# Altium schematic sheet VMA.SchDoc
size A3; SheetNumber: 4; SheetTotal: 4
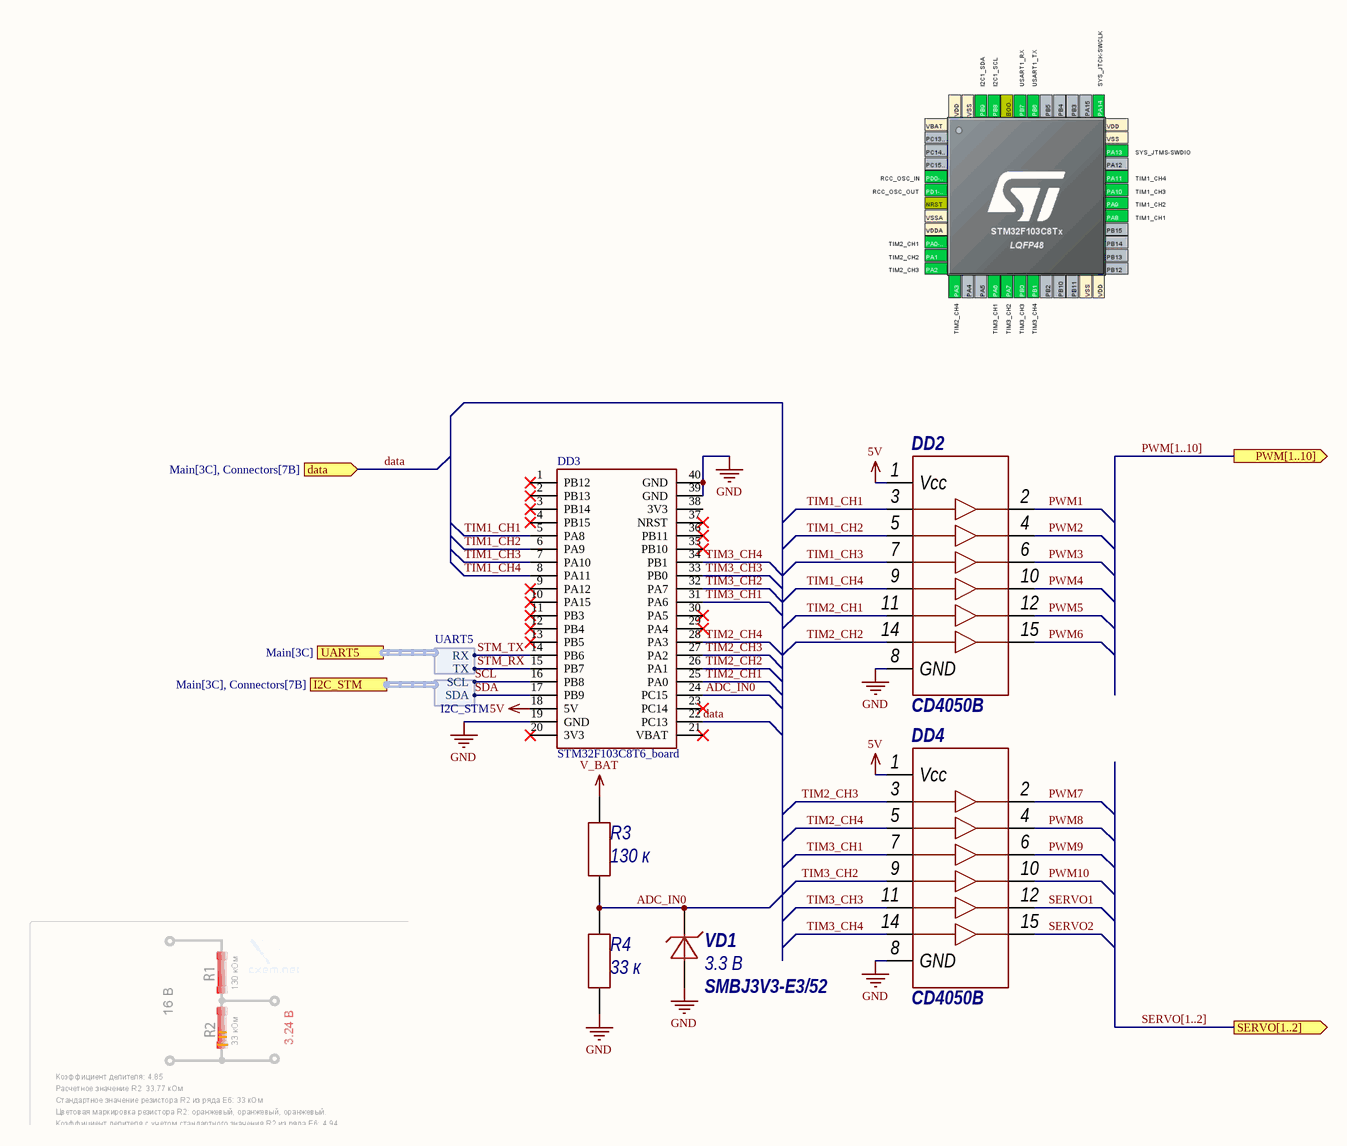
[diagram p0: VMA.SchDoc]

## Parts
DD2  CD4050B  [DIP16_in_socket]
DD3  STM32F103C8T6_board  [STM32F103C8T6_board]
DD4  CD4050B  [DIP16_in_socket]
R3  value 130 к  [0603R]  (hidden comment: Resistor)
R4  value 33 к  [0603R]  (hidden comment: Resistor)
VD1  SMBJ3V3-E3/52  value 3.3 В  [SMB]

## Ports
data (in, see Main[3C], Connectors[7B]), I2C_STM (harness I2C_STM, see Main[3C], Connectors[7B]), PWM[1..10] (out, see Main[3C], Connectors[7C]), SERVO[1..2] (out, see Main[3C], Connectors[7C]), UART5 (harness UART5, see Main[3C])

## Harnesses
UART5: TX, RX
I2C_STM: SCL, SDA

## Nets
5V: DD2.1(Vcc) DD3.18(5V) DD4.1(Vcc)
GND: DD2.8(GND) DD3.19(GND) DD3.39(GND) DD3.40(GND) DD4.8(GND) R4.1 VD1.1
V_BAT: R3.2
ADC_IN0: DD3.24(PC15) R3.1 R4.2 VD1.2
data: DD3.22(PC13) ; port data
PWM1: DD2.2(Y1)
PWM2: DD2.4(Y2)
PWM3: DD2.6(Y3)
PWM4: DD2.10(Y10)
PWM5: DD2.12(Y5)
PWM6: DD2.15(Y6)
PWM7: DD4.2(Y1)
PWM8: DD4.4(Y2)
PWM9: DD4.6(Y3)
PWM10: DD4.10(Y10)
SCL: DD3.16(PB8) ; port I2C_STM.SCL
SDA: DD3.17(PB9) ; port I2C_STM.SDA
SERVO1: DD4.12(Y5)
SERVO2: DD4.15(Y6)
STM_RX: DD3.15(PB7) ; port UART5.TX
STM_TX: DD3.14(PB6) ; port UART5.RX
TIM1_CH1: DD2.3(A1) DD3.5(PA8)
TIM1_CH2: DD2.5(A2) DD3.6(PA9)
TIM1_CH3: DD2.7(A3) DD3.7(PA10)
TIM1_CH4: DD2.9(A4) DD3.8(PA11)
TIM2_CH1: DD2.11(A5) DD3.25(PA0)
TIM2_CH2: DD2.14(A6) DD3.26(PA1)
TIM2_CH3: DD3.27(PA2) DD4.3(A1)
TIM2_CH4: DD3.28(PA3) DD4.5(A2)
TIM3_CH1: DD3.31(PA6) DD4.7(A3)
TIM3_CH2: DD3.32(PA7) DD4.9(A4)
TIM3_CH3: DD3.33(PB0) DD4.11(A5)
TIM3_CH4: DD3.34(PB1) DD4.14(A6)

Not connected (* = marked no-connect by the designer): DD3 1(PB12)* 2(PB13)* 3(PB14)* 4(PB15)* 9(PA12)* 10(PA15)* 11(PB3)* 12(PB4)* 13(PB5)* 20(3V3)* 21(VBAT)* 23(PC14)* 29(PA4)* 30(PA5)* 35(PB10)* 36(PB11)* 37(NRST)* 38(3V3)

## Buses and harness runs
bus PWM[1..10] = port PWM[1..10]
bus SERVO[1..2] = port SERVO[1..2]

## Library data of the parts
DD2 DD4 = CD4050B: Шесть буферных элементов; Part Number: CD4050B
DD3 = STM32F103C8T6_board: blue pill; Part Number: STM32F103C8T6_board
R3 = Resistor_130k_1_0603: Резистор номиналом 130 кОм и точностью 1%; Power: *; Part Number: Resistor_130k_1_0603; Tolerance: 1%
R4 = Resistor_33k_1_0603: Резистор номиналом 33 кОм и точностью 1%; Power: *; Part Number: Resistor_33k_1_0603; Tolerance: 1%
VD1 = SMBJ15A: Защитный диод на 15 В, рассеиваемая мощность 600 Вт; Voltage nominal (V): 15; Power (W): 600; Part Number: SMBJ15A; ComponentLink1Description: Где купить; ComponentLink1URL: https://www.chipdip.ru/product/smbj3v3-e3-52-2